# EAGLE design gluecksrad (EAGLE 6.6.0)
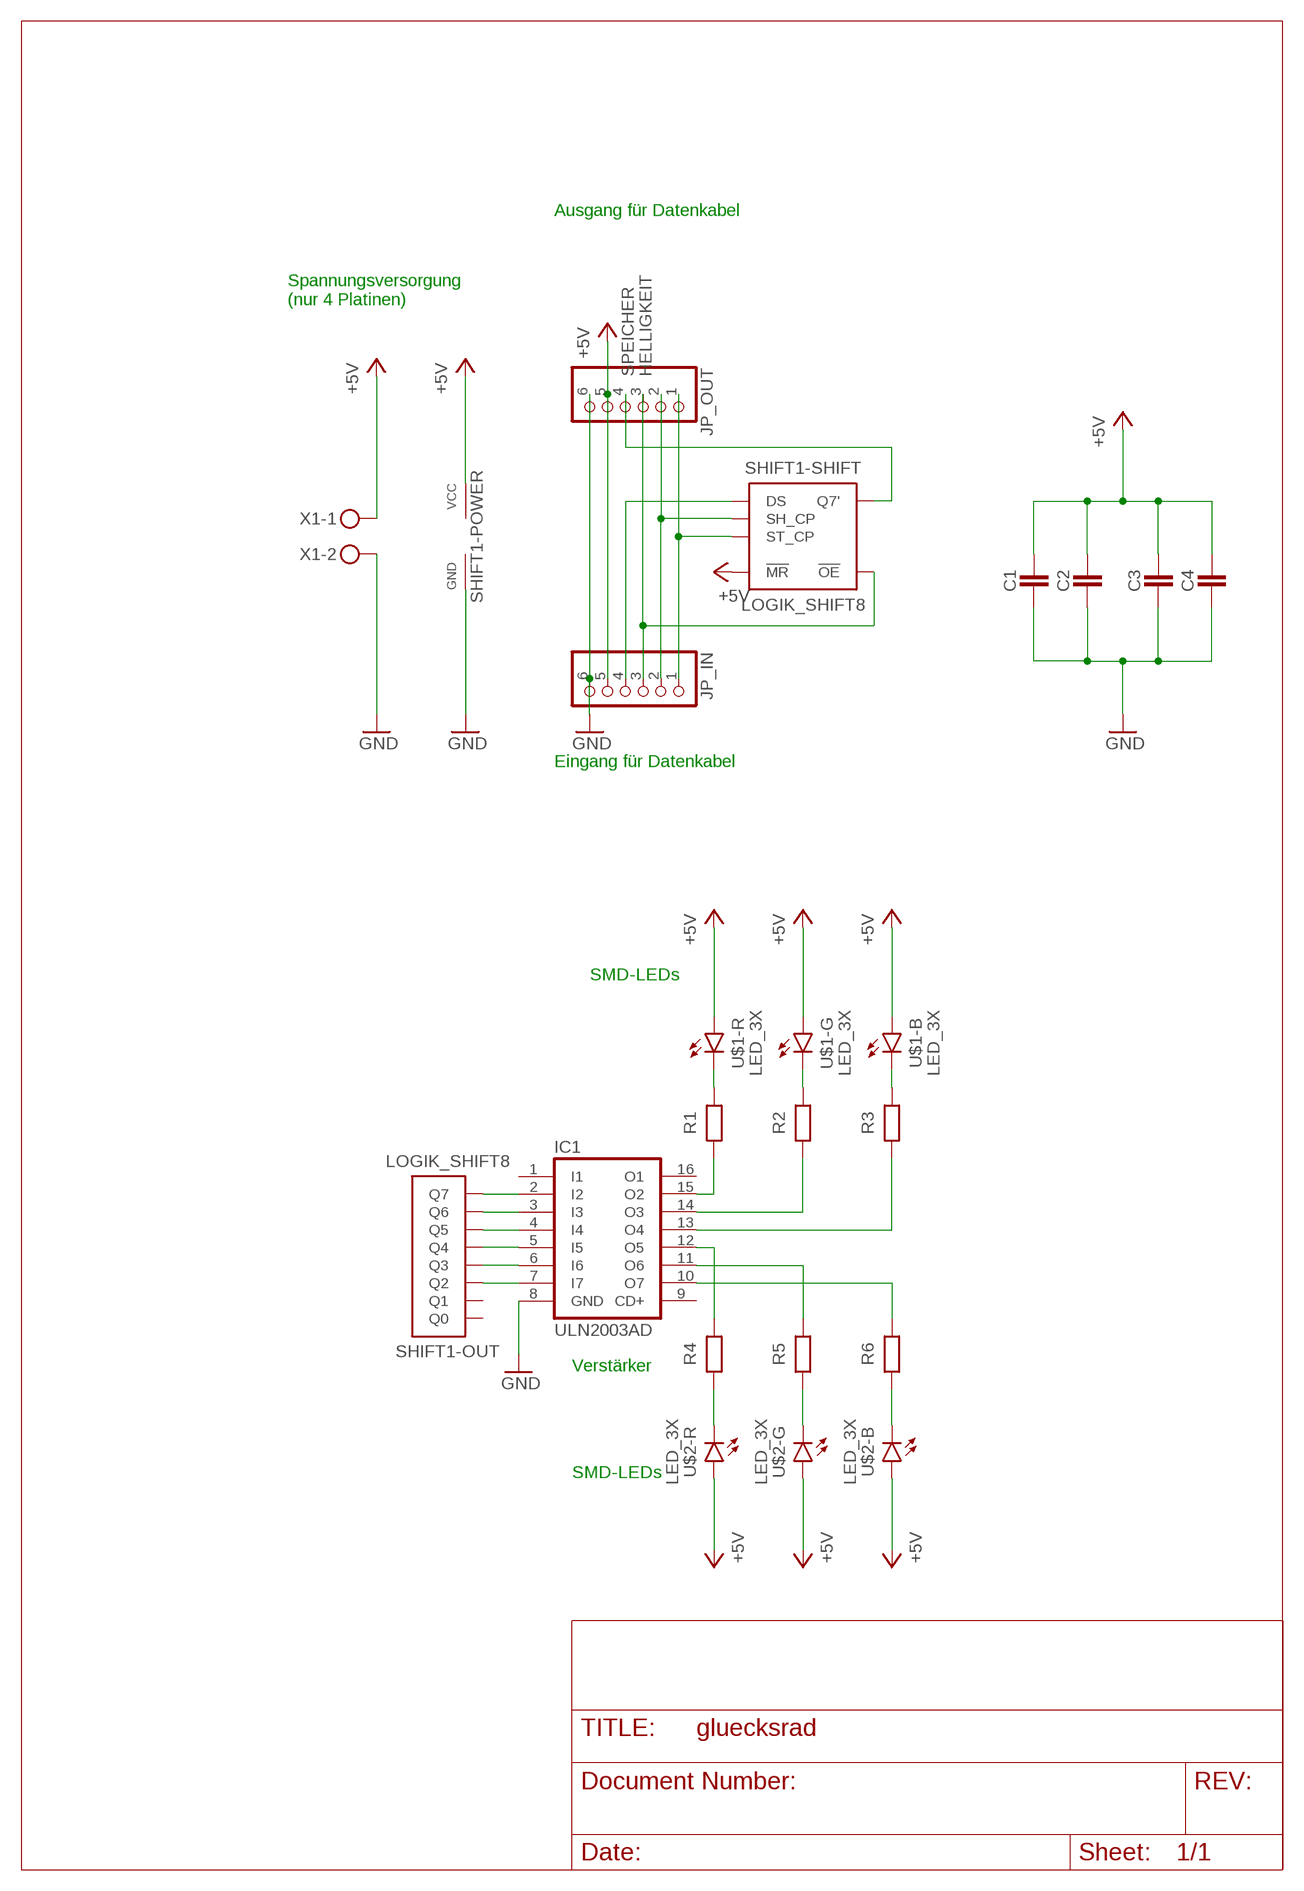
[diagram p0: schematic, sheet 1]

## Parts
C1  CAPACITATOR-2,5MM  [C_THT_2]
C2  CAPACITATOR-5MM  [C_THT_3]
C3  CAPACITATOR-2,5MM  [C_THT_2]
C4  CAPACITATOR-2,5MM  [C_THT_2]
IC1  ULN2003AD  [SO16]
JP_IN  PINHD-1X6/90  [1X06/90]
JP_OUT  PINHD-1X6/90  [1X06/90]
R1  RESISTOR-10MM  [R_THT_4]
R2  RESISTOR-10MM  [R_THT_4]
R3  RESISTOR-10MM  [R_THT_4]
R4  RESISTOR-10MM  [R_THT_4]
R5  RESISTOR-10MM  [R_THT_4]
R6  RESISTOR-10MM  [R_THT_4]
SHIFT1  LOGIK_SHIFT8  [IC_SOIC16]
U$1  LED_3X  [LED_TOP_PLCC6]
U$2  LED_3X  [LED_TOP_PLCC6]
X1  STECKER_SPG_2  [STECKER_SPG_2]

## Nets
+5V: C1.1 C2.1 C3.1 C4.1 JP_IN.5 JP_OUT.5 SHIFT1.P$10(-SHIFT:!MR) SHIFT1.P$16(-POWER:VCC) U$1.1(-R:A) U$1.3(-G:A) U$1.4(-B:A) U$2.1(-R:A) U$2.3(-G:A) U$2.4(-B:A) X1.1
GND: C1.2 C2.2 C3.2 C4.2 IC1.8(GND) JP_IN.6 JP_OUT.6 SHIFT1.P$8(-POWER:GND) X1.2
HELLIGKEIT: JP_IN.3 JP_OUT.3 SHIFT1.P$13(-SHIFT:!OE)
N$1: IC1.4(I4) SHIFT1.P$5(-OUT:Q5)
N$2: IC1.3(I3) SHIFT1.P$6(-OUT:Q6)
N$3: IC1.7(I7) SHIFT1.P$2(-OUT:Q2)
N$4: IC1.2(I2) SHIFT1.P$7(-OUT:Q7)
N$5: IC1.6(I6) SHIFT1.P$3(-OUT:Q3)
N$6: IC1.15(O2) R1.2
N$7: IC1.14(O3) R2.2
N$8: IC1.13(O4) R3.2
N$9: IC1.12(O5) R4.1
N$10: IC1.11(O6) R5.1
N$11: IC1.10(O7) R6.1
N$12: R1.1 U$1.6(-R:C)
N$13: R2.1 U$1.2(-G:C)
N$14: R3.1 U$1.5(-B:C)
N$15: R4.2 U$2.6(-R:C)
N$16: R5.2 U$2.2(-G:C)
N$17: R6.2 U$2.5(-B:C)
N$18: IC1.5(I5) SHIFT1.P$4(-OUT:Q4)
N$19: JP_OUT.4 SHIFT1.P$9(-SHIFT:Q7')
N$20: JP_IN.4 SHIFT1.P$14(-SHIFT:DS)
N$21: JP_IN.2 JP_OUT.2 SHIFT1.P$11(-SHIFT:SH_CP)
SPEICHER: JP_IN.1 JP_OUT.1 SHIFT1.P$12(-SHIFT:ST_CP)
Unconnected: IC1.1(I1) IC1.9(CD+) IC1.16(O1) SHIFT1.P$1(-OUT:Q1) SHIFT1.P$15(-OUT:Q0)

## Notes on the sheet
- Ausgang für Datenkabel
- Spannungsversorgung
  (nur 4 Platinen)
- Eingang für Datenkabel
- SMD-LEDs
- Verstärker
- SMD-LEDs

## Library data of the parts
C1-C4 = robo_ag:CAPACITATOR: Kondensator
IC1 = uln-udn:ULN2003A: DRIVER ARRAY
JP_IN JP_OUT = pinhead:PINHD-1X6: PIN HEADER
R1-R6 = robo_ag:RESISTOR: Widerstand Reichelt: METALL x,xx[k]
SHIFT1 = robo_ag:LOGIK_SHIFT8: Logikgatter Reichelt: SMD HC 595 Schieberegister 8bit 5V
U$1 U$2 = robo_ag:LED_3X: Led Reichelt: LRTB G6TG 280/900/180 mcd 2,1/3,2/3,2 V 20mA RGB-Led SMD
X1 = robo_ag:STECKER_SPG_2: Anschlussklemme Reichelt:AKL 101-02 Nicht Anreihbar Reichelt:AKL 057-02 Anreihbar

## Board
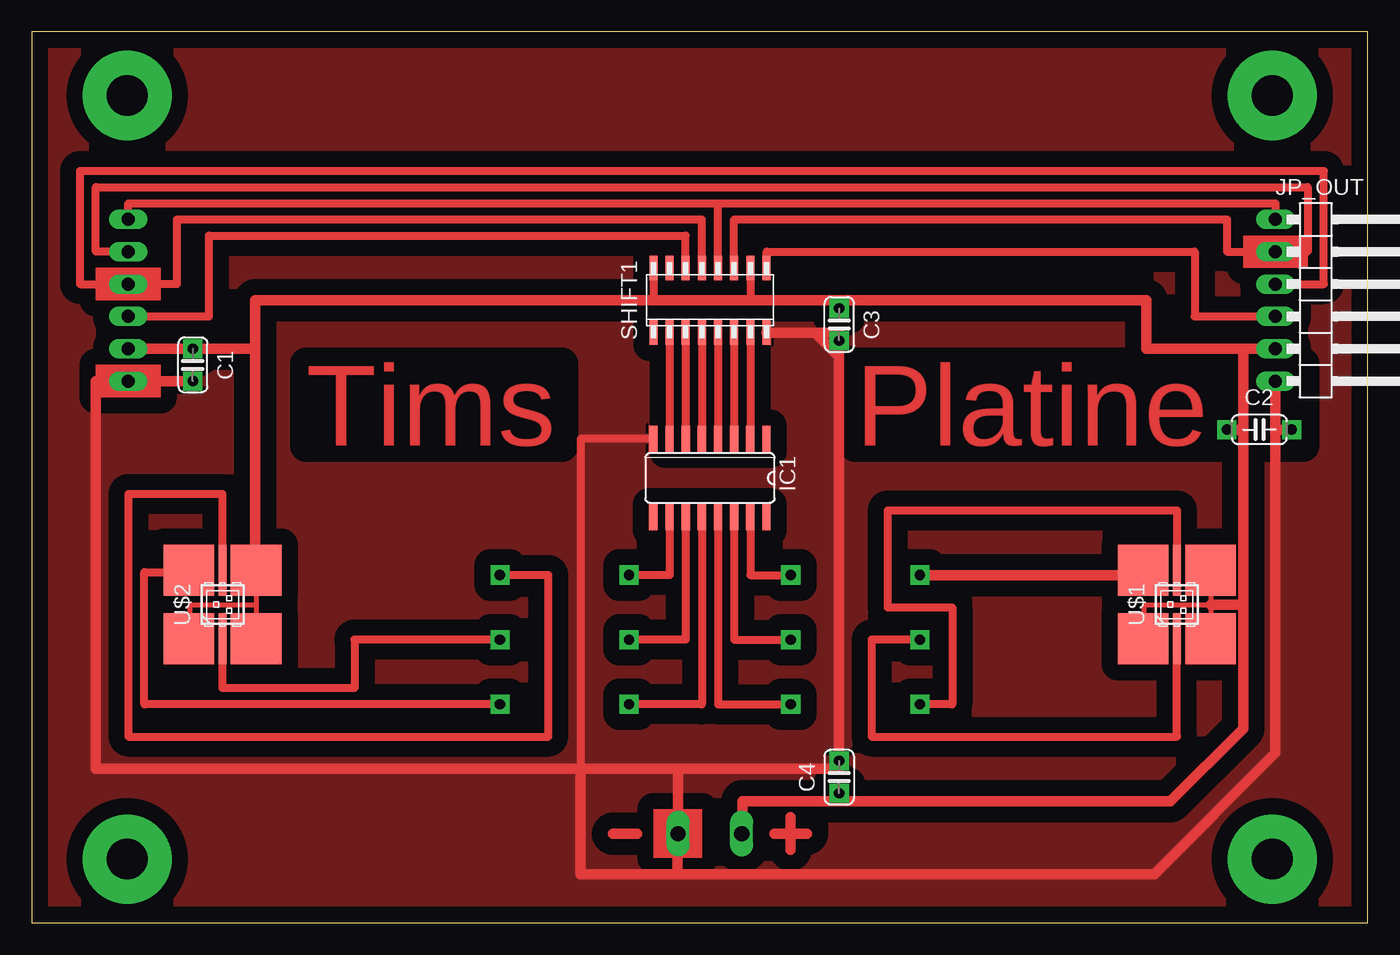
[diagram p1: board, top side]
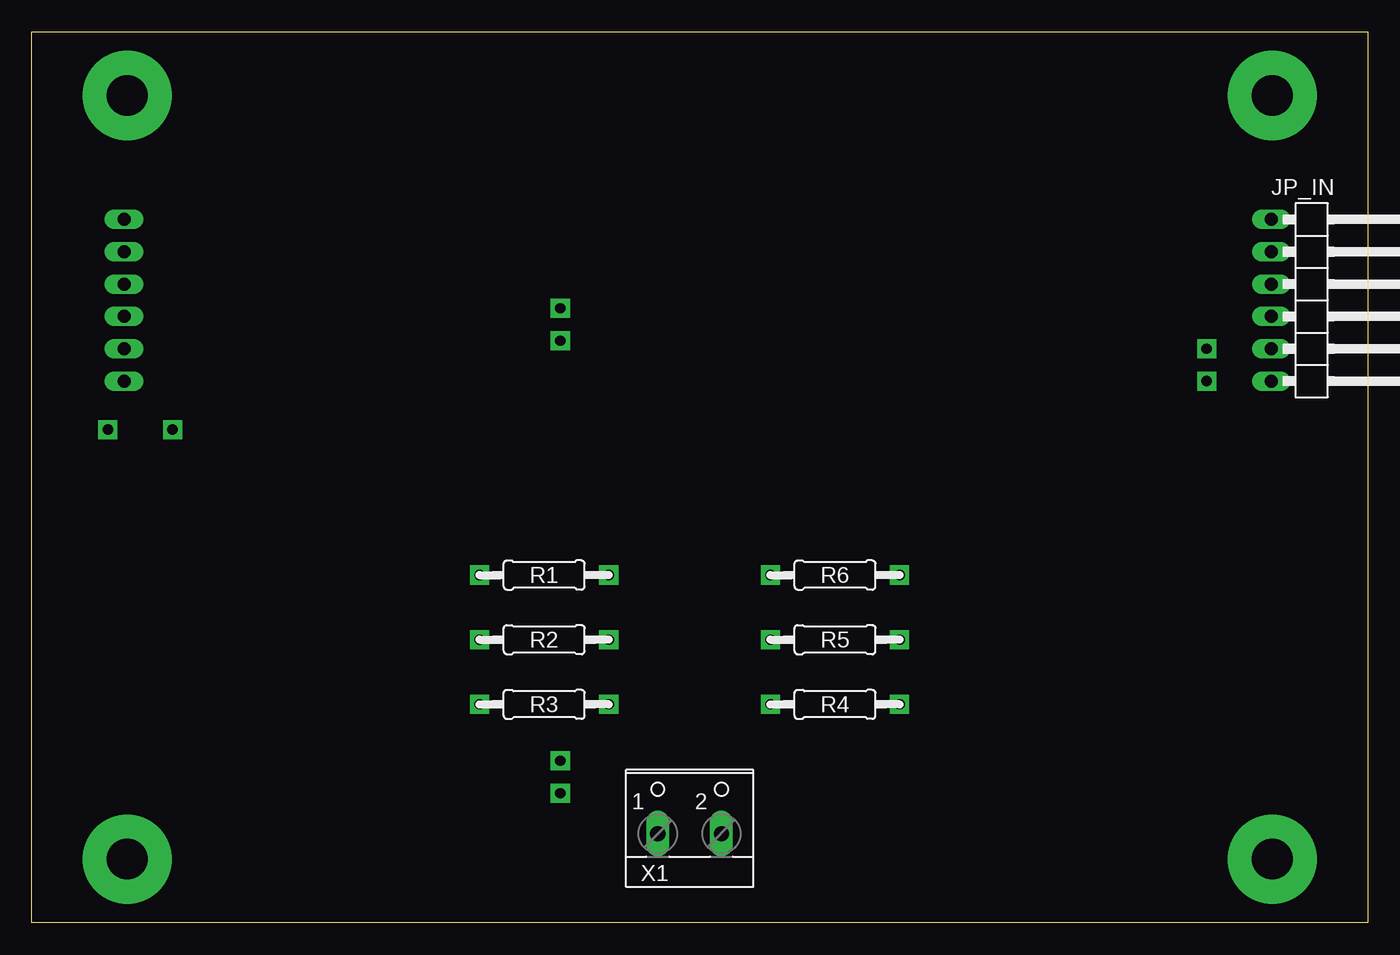
[diagram p2: board, bottom side, seen from below]

Size 105 x 70 mm. Coordinates in mm from the lower left corner, seen from the top.
Outline: 0,0 105,0 105,70 0,70 0,0
Copper layers (1*16): Top 0.035mm / dielectric 1.5mm / Bottom 0.035mm
Design rules "default": minimum track width 10mil, minimum drill 24mil, track to track 8mil, track to pad 8mil, pad to pad 8mil, via to via 8mil, smd to smd 8mil, copper to edge 40mil, drill to drill 8mil, minimum pad ring 10mil, minimum via ring 8mil, stop-mask expansion 4mil, vias tented up to drill 0mil, thermal gap 10mil

### Footprints (pad centres in the part's own frame; a part is rotated, then mirrored left to right if it is on the bottom)
C_THT_2 = drill 0.8 pad 1.5 square: 1 -1.27,0; 2 1.27,0
C_THT_3 = drill 0.8 pad 1.5 square: 1 -2.54,0; 2 2.54,0
SO16 = smd 0.66 x 2.032: 1 -4.445,-3.073; 2 -3.175,-3.073; 3 -1.905,-3.073; 4 -0.635,-3.073; 5 0.635,-3.073; 6 1.905,-3.073; 7 3.175,-3.073; 8 4.445,-3.073; 9 4.445,3.073; 10 3.175,3.073; 11 1.905,3.073; 12 0.635,3.073; 13 -0.635,3.073; 14 -1.905,3.073; 15 -3.175,3.073; 16 -4.445,3.073
1X06/90 = drill 1.016 long: 1 -6.35,-3.81; 2 -3.81,-3.81; 3 -1.27,-3.81; 4 1.27,-3.81; 5 3.81,-3.81; 6 6.35,-3.81
R_THT_4 = drill 0.8 pad 1.5 square: 1 -5.08,0; 2 5.08,0
IC_SOIC16 = smd 1.905 x 0.635: P$1 -2.54,4.445; P$2 -2.54,3.175; P$3 -2.54,1.905; P$4 -2.54,0.635; P$5 -2.54,-0.635; P$6 -2.54,-1.905; P$7 -2.54,-3.175; P$8 -2.54,-4.445; P$9 2.54,-4.445; P$10 2.54,-3.175; P$11 2.54,-1.905; P$12 2.54,-0.635; P$13 2.54,0.635; P$14 2.54,1.905; P$15 2.54,3.175; P$16 2.54,4.445
LED_TOP_PLCC6 = smd 4 x 4: 1 -2.65,-2.7; 3 2.65,-2.7; 4 2.65,2.7; 6 -2.65,2.7 | smd 0.6 x 4: 2 0,-2.7; 5 0,2.7
STECKER_SPG_2 = drill 1.194 long: 1 -2.5,-1.27; 2 2.5,-1.27

### Placement (x,y rotation side)
C1  12.66,43.83 270 top
C2  96.48,38.75 0 top
C3  63.46,47.01 270 top
C4  63.46,11.45 90 top
IC1  53.3,34.94 180 top
JP_IN  3.77,48.91 270 bottom
JP_OUT  101.56,48.91 270 top
R1  64.73,27.32 0 bottom
R2  64.73,22.24 0 bottom
R3  64.73,17.16 0 bottom
R4  41.87,17.16 0 bottom
R5  41.87,22.24 0 bottom
R6  41.87,27.32 0 bottom
SHIFT1  53.3,48.91 90 top
U$1  90,25 0 top
U$2  15,25 0 top
X1  53.3,8.27 0 bottom

### Tracks (layer width: path | path; a pad name or v marks a point on that pad's centre or on a via)
+5V
  Top 0.406: U$2.4 17.65,25 | 17.65,25 U$2.3 | U$2.1 12.46,22.3 12.46,25 17.65,25 | U$1.1 87.46,22.3 87.46,25 92.65,25 | 92.65,25 U$1.4 92.54,27.7 92.54,27.54 | 92.65,25 U$1.3
  Top 0.61: SHIFT1.P$10 56.48,48.91 | SHIFT1.P$16 48.85,48.91
  Top 0.813: JP_IN.5 C1.1 17.54,45.1 | 95.21,25 92.65,25 | 95.21,45.1 87.59,45.1 87.59,48.91 63.46,48.91 | 95.21,45.1 JP_OUT.5 | 17.54,45.1 17.54,48.91 48.85,48.91 56.48,48.91 63.46,48.91 | 95.21,25 95.21,15.26 89.5,9.54 63.46,9.54 | C3.1 63.46,48.91 | 95.21,25 95.21,38.75 | 95.21,38.75 95.21,45.1 | C2.1 95.21,38.75 | X1.1 55.84,7 55.84,9.54 63.46,9.54 | C4.1 63.46,9.54 | 17.54,45.1 17.54,27.7 U$2.4
GND
  Top 0.406: X1.2 50.76,7 | IC1.8 48.22,38.01
  Top 0.61: 43.14,12.08 43.14,38.01 IC1.8
  Top 0.813: 43.14,12.08 43.14,3.83 50.76,3.83 | 63.46,44.47 C3.2 63.46,46.37 61.55,46.37 | 63.46,44.47 C4.2 63.46,12.08 50.8,12.08 X1.2 | 50.76,7 50.76,3.83 | C1.2 JP_IN.6 5.04,42.56 5.04,12.08 43.14,12.08 | 50.76,3.83 88.22,3.83 97.75,13.35 97.75,38.75 | SHIFT1.P$8 61.55,46.37 | 61.55,46.37 63.46,44.47 | JP_OUT.6 97.75,38.75 | C2.2 97.75,38.75 | 43.14,12.08 50.76,12.08
  pour Top (isolate 1.27): 0,70 0,0 105,0 105,70
HELLIGKEIT
  Top 0.61: JP_OUT.3 101.56,50.18 101.56,59.07 3.77,59.07 3.77,50.18 JP_IN.3 11.39,50.18 11.39,55.26 52.66,55.26 SHIFT1.P$13
N$1
  Top 0.61: SHIFT1.P$5 IC1.4
N$2
  Top 0.61: SHIFT1.P$6 IC1.3
N$3
  Top 0.61: SHIFT1.P$2 IC1.7
N$4
  Top 0.61: SHIFT1.P$7 IC1.2
N$5
  Top 0.61: SHIFT1.P$3 IC1.6
N$6
  Top 0.61: R1.2 56.48,27.32 IC1.15
N$7
  Top 0.61: IC1.14 55.2,22.24 R2.2
N$8
  Top 0.61: IC1.13 53.94,17.16 R3.2
N$9
  Top 0.61: R4.1 52.66,17.16 IC1.12
N$10
  Top 0.61: R5.1 51.4,22.24 IC1.11
N$11
  Top 0.61: R6.1 50.12,27.32 IC1.10
N$12
  Top 0.813: U$1.6 87.35,27.32 R1.1
N$13
  Top 0.61: R2.1 66,22.24 66,14.62 90,14.62 U$1.2
N$14
  Top 0.61: U$1.5 90,32.4 67.27,32.4 67.27,24.78 72.35,24.78 72.35,17.16 R3.1
N$15
  Top 0.406: 12.46,27.54 12.35,27.54 U$2.6
  Top 0.61: R4.2 8.85,17.16 8.85,27.54 12.35,27.54
N$16
  Top 0.61: R5.2 25.36,22.24 25.36,18.43 15,18.43 U$2.2
N$17
  Top 0.61: U$2.5 15,33.67 7.58,33.67 7.58,14.62 40.6,14.62 40.6,27.32 R6.2
N$18
  Top 0.61: SHIFT1.P$4 IC1.5
N$19
  Top 0.61: SHIFT1.P$9 57.74,52.72 91.4,52.72 91.4,47.64 JP_OUT.4
N$20
  Top 0.61: JP_IN.4 13.93,47.64 13.93,53.99 51.4,53.99 SHIFT1.P$14
N$21
  Top 0.61: JP_IN.2 5.04,52.72 5.04,57.8 100.29,57.8 100.29,52.72 JP_OUT.2 93.94,52.72 93.94,55.26 55.2,55.26 SHIFT1.P$11
N$22  (via drill 3.2 pad 7)
  other vias: 7.5,5
N$23  (via drill 3.2 pad 7)
  other vias: 7.5,65
N$24  (via drill 3.2 pad 7)
  other vias: 97.5,5
N$25  (via drill 3.2 pad 7)
  other vias: 97.5,65
N$26
  Top 0.813: 45.68,7 47.59,7
N$27
  Top 0.813: 58.38,7 60.92,7
N$28
  Top 0.813: 59.65,8.27 59.65,5.73
SPEICHER
  Top 0.61: SHIFT1.P$12 53.94,56.53 | JP_IN.1 7.58,56.53 53.94,56.53 | 53.94,56.53 97.75,56.53 JP_OUT.1
(copper drawn outside any net)
  shapes: Top area x4

### Text on the board
Top: Tims | Platine